# EAGLE schematic USV-BG-002-SP-A (EAGLE 9.6.2)
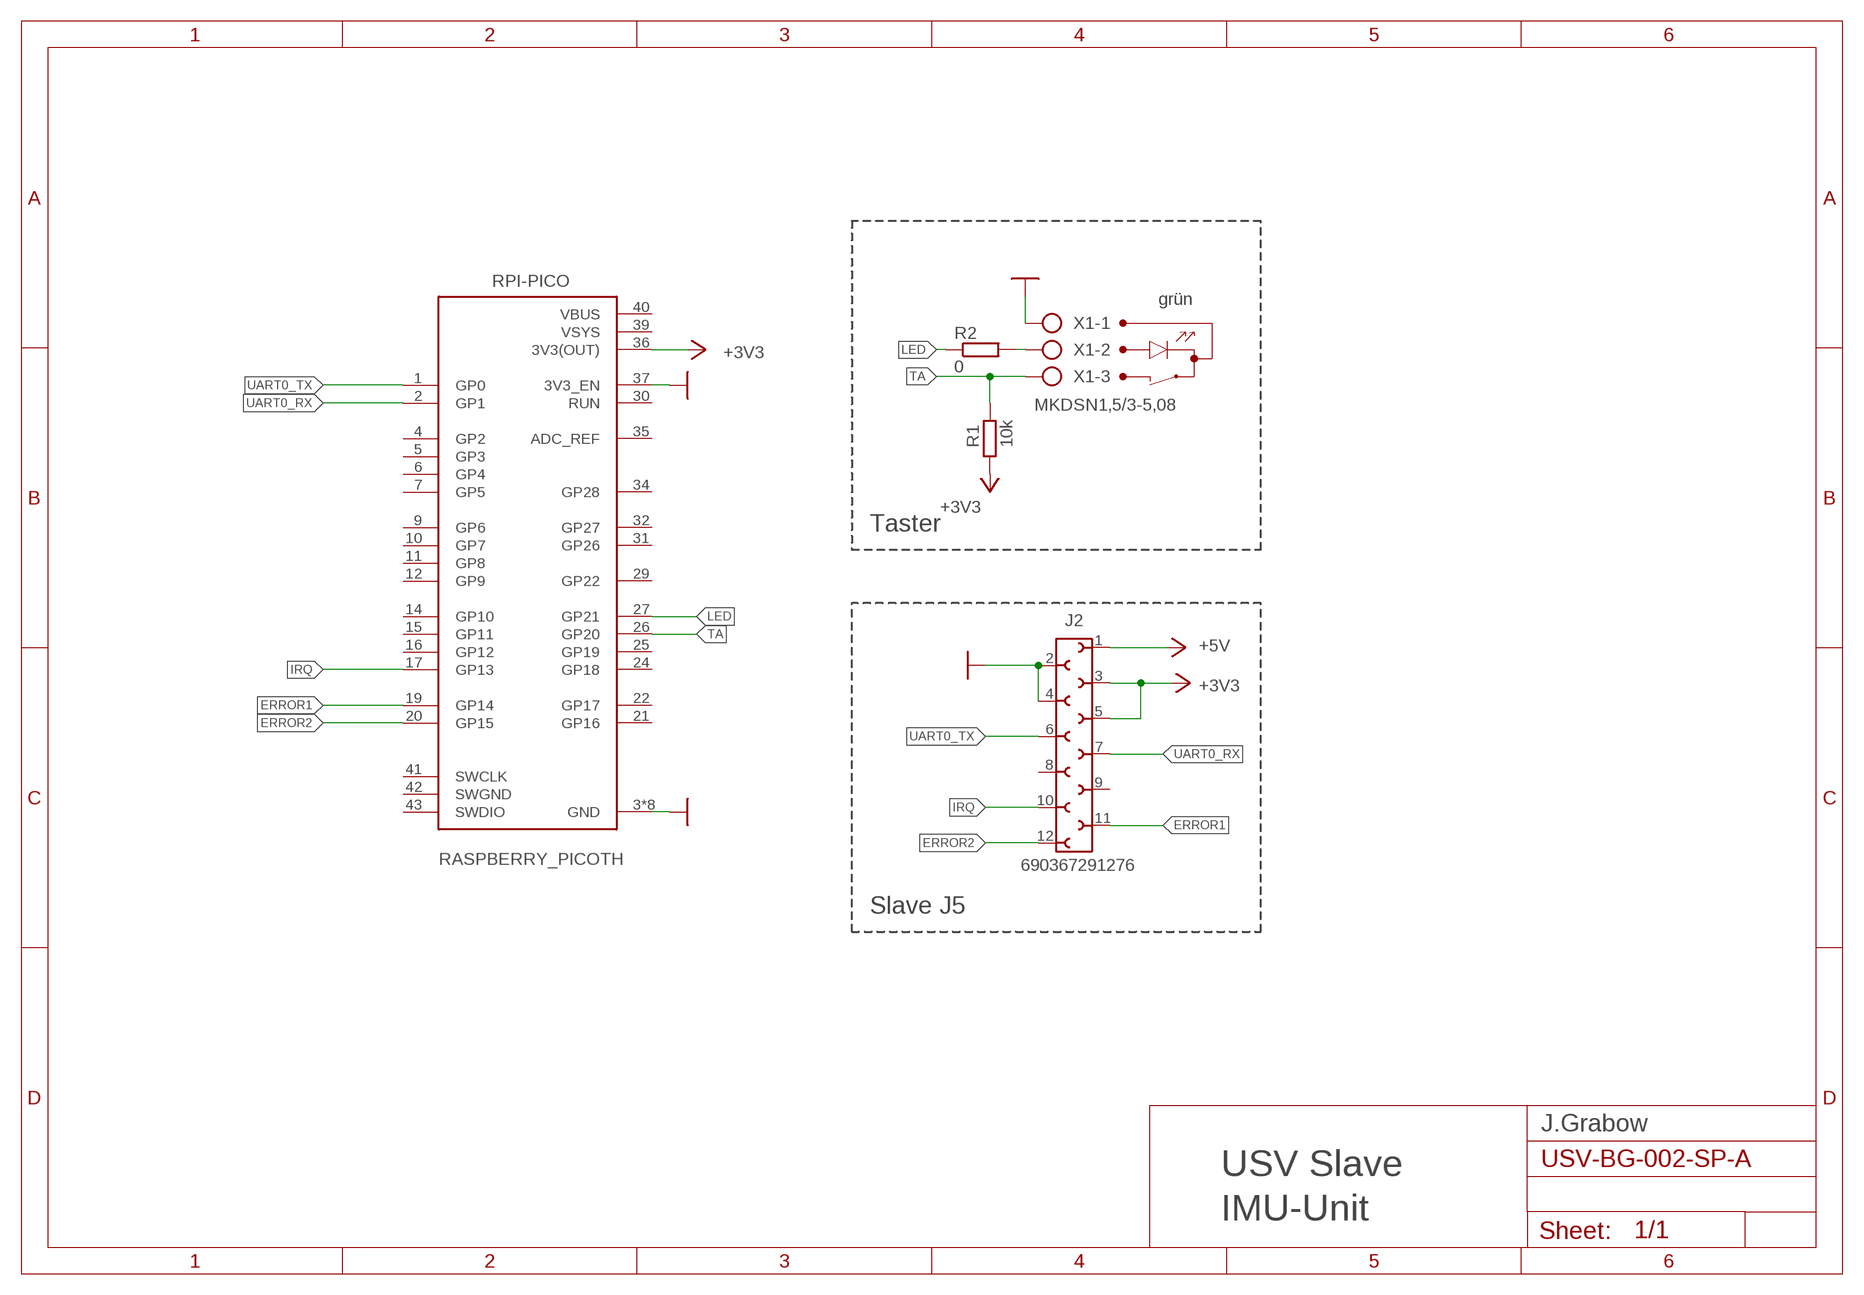
[diagram p0: schematic, sheet 1]

## Parts
J2  690367291276  [690367291276]
R1  10k  R-EU_M0805  [M0805]
R2  0  R-EU_R0805  [R0805]
RPI-PICO  RASPBERRY_PICOTH  [PICO-PKG-TH]
X1  MKDSN1,5/3-5,08  [MKDSN1,5/3-5,08]

## Nets
+3V3: J2.3 J2.5 R1.1 RPI-PICO.36(3V3(OUT))
+5V: J2.1
ERROR1: J2.11 RPI-PICO.19(GP14)
ERROR2: J2.12 RPI-PICO.20(GP15)
GND: J2.2 J2.4 RPI-PICO.3(GND) RPI-PICO.8(GND) RPI-PICO.13(GND) RPI-PICO.18(GND) RPI-PICO.23(GND) RPI-PICO.28(GND) RPI-PICO.33(GND) RPI-PICO.37(3V3_EN) RPI-PICO.38(GND) X1.1
IRQ: J2.10 RPI-PICO.17(GP13)
LED: R2.1 RPI-PICO.27(GP21)
LED/IO2A: R2.2 X1.2
TA: R1.2 RPI-PICO.26(GP20) X1.3
UART0_RX: J2.7 RPI-PICO.2(GP1)
UART0_TX: J2.6 RPI-PICO.1(GP0)
Unconnected: J2.8 J2.9 RPI-PICO.4(GP2) RPI-PICO.5(GP3) RPI-PICO.6(GP4) RPI-PICO.7(GP5) RPI-PICO.9(GP6) RPI-PICO.10(GP7) RPI-PICO.11(GP8) RPI-PICO.12(GP9) RPI-PICO.14(GP10) RPI-PICO.15(GP11) RPI-PICO.16(GP12) RPI-PICO.21(GP16) RPI-PICO.22(GP17) RPI-PICO.24(GP18) RPI-PICO.25(GP19) RPI-PICO.29(GP22) RPI-PICO.30(RUN) RPI-PICO.31(GP26) RPI-PICO.32(GP27) RPI-PICO.34(GP28) RPI-PICO.35(ADC_REF) RPI-PICO.41(SWCLK) RPI-PICO.43(SWDIO)

## Notes on the sheet
- grün
- Taster
- Slave J5
- J.Grabow
- USV Slave
- IMU-Unit

## Power pins joined to a net without a drawn wire
SWGND: RPI-PICO.42(SWGND)
VBUS: RPI-PICO.40(VBUS)
VSYS: RPI-PICO.39(VSYS)

## Library data of the parts
J2 = Eagle_WR-MM (rev20b):690367291276: WR-MM Female SMT Connector with Latch & Polarization KIND PROPERTIES: Pitch 2.54 mm Gender:Female MATERIAL PROPERTIES: Insulator Material:PA6T Insulator Flammability Rating UL94 V-0 Insulator Color:Red Contact Material :Phosphor Bronze Contact Plating :Mat Tin over Nickel Contact Type: Stamped GENERAL PROPERTIES: Operating Temperature:-40 °C up to +105 °C Compliance Lead free / RoHS ELECTRICAL PROPERTIES: Working Voltage 100 V (AC) Withstanding Voltage:500 V (AC) Contact Resistance: 10 mΩ Insulation Resistance:1000 MΩ PACKAGING PROPERTIES: cULus Approval:E323964 Packaging :Tape and Reel <https://katalog.we-online.com/media/images/v2/o33161v209%20WR-MiMo_69036729xx76.jpg> Details see: Web 1: https://katalog.we-online.com/en/em/MM_1_27_SMT_FEMALE_CONNECTOR_WITH_LATCH_AND_POLARIZATION_69036729XX76_2 Web2: https://katalog.we-online.com/en/em/MM_1_27_SMT_FEMALE_CONNECTOR_WITH_LATCH_AND_POLARIZATION_69036729XX76 Updated by Yingchun,Shan 2019-10-28 2019 (C) Würth Elektronik; DATASHEET-URL: https://www.we-online.com/catalog/datasheet/690367291276.pdf; GENDER: Female; IR: 1.5A; PACKAGING: Tape and Reel; PART-NUMBER: 690367291276; PINS: 12; PITCH: 2.54; TYPE: Straight
R1 R2 = rcl:R-EU_: RESISTOR, European symbol; SPICEPREFIX: R
RPI-PICO = RpiPico:RASPBERRY_PICO: Raspberry Pi Pico
X1 = con-phoenix-508:MKDSN1,5/3-5,08: MKDSN 1,5/ 3-5,08 Printklemme Nennstrom: 13,5 A Nennspannung: 250 V Rastermaß: 5,08 mm Polzahl: 3 Anschlussart: Schraubanschluss Montage: Löten Anschlussrichtung Leiter/Platine: 0 ° Artikelnummer: 1729131 Source: http://eshop.phoenixcontact.com .. 1729131.pdf